# Altium schematic sheet Sheet1.SchDoc
size A4; SheetNumber: 1; SheetTotal: 1
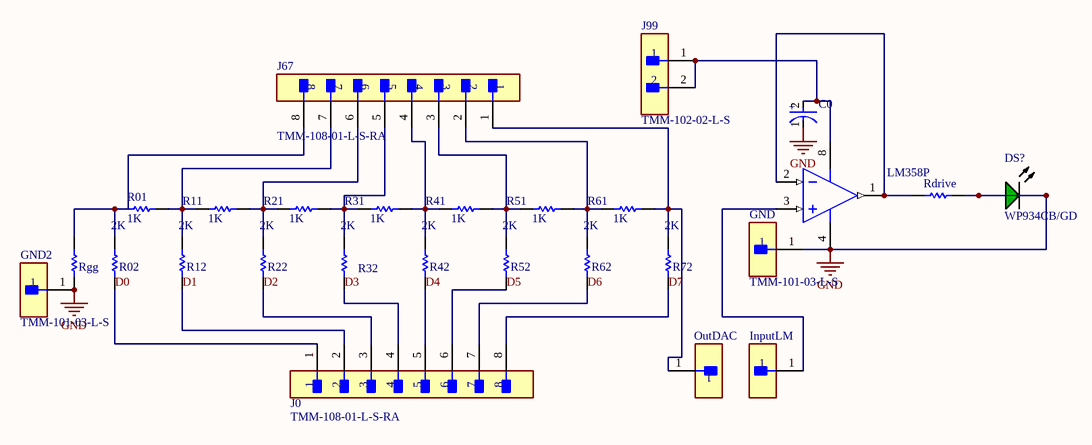
[diagram p0: Sheet1.SchDoc]

## Parts
C0  C0  [FP-RAD-TH-D_10_0_5-L_16_1-MFG]  (value not drawn)
DS?  WP934CB/GD  [KING-WP934CBGD_V]
GND  TMM-101-03-L-S  [FP-TMM-101-03-L-S-MFG]
GND2  TMM-101-03-L-S  [FP-TMM-101-03-L-S-MFG]
InputLM  TMM-101-03-L-S  [FP-TMM-101-03-L-S-MFG]  (value not drawn)
J0  TMM-108-01-L-S-RA  [FP-TMM-108-01-L-S-RA-MFG]
J67  TMM-108-01-L-S-RA  [FP-TMM-108-01-L-S-RA-MFG]
J99  TMM-102-02-L-S  [FP-TMM-102-02-L-S-MFG]
OutDAC  TMM-101-03-L-S  [FP-TMM-101-03-L-S-MFG]  (value not drawn)
R01  1K  [RESA60-630X240]
R02  2K  [RESA60-630X240]
R11  1K  [RESA60-630X240]
R12  2K  [RESA60-630X240]
R21  1K  [RESA60-630X240]
R22  2K  [RESA60-630X240]
R31  1K  [RESA60-630X240]
R32  2K  [RESA60-630X240]
R41  1K  [RESA60-630X240]
R42  2K  [RESA60-630X240]
R51  1K  [RESA60-630X240]
R52  2K  [RESA60-630X240]
R61  1K  [RESA60-630X240]
R62  2K  [RESA60-630X240]
R72  2K  [RESA60-630X240]
Rdrive  drive  [RESA60-630X240]  (value not drawn)
Rgg  gg  [RESA60-630X240]  (value not drawn)
  LM358P  [P0008A]  (part A of 2)

## Nets
GND: C0.1(C) DS?.1(K) DS?.2(A) GND.1 GND2.1 Rdrive.2 Rgg.1 .4(GND)
D0: J0.1 R02.1
D1: J0.2 R12.1
D2: J0.3 R22.1
D3: J0.4 R32.1
D4: J0.5 R42.1
D5: J0.6 R52.1
D6: J0.7 R62.1
D7: J0.8 R72.1
NetC0_2: C0.2(A) J99.1 J99.2 .8(VCC)
NetInputLM_1: InputLM.1 .3(1IN+)
NetJ67_1: J67.1 OutDAC.1 R61.2 R72.2
NetJ67_2: J67.2 R51.2 R61.1 R62.2
NetJ67_3: J67.3 R41.2 R51.1 R52.2
NetJ67_4: J67.4 R31.2 R41.1 R42.2
NetJ67_5: J67.5 R21.2 R31.1 R32.2
NetJ67_6: J67.6 R11.2 R21.1 R22.2
NetJ67_7: J67.7 R01.2 R11.1 R12.2
NetJ67_8: J67.8 R01.1 R02.2 Rgg.2
NetRdrive_1: Rdrive.1 .1(1OUT) .2(1IN-)

## Notes on the sheet
- (in symbol CMP-05427-000698-1) +

## Library data of the parts
C0 = CMP-05427-000698-1: Aluminum Electrolytic Capacitors (Radial Lead Type) AEC-Q200 Qualified 330uF ±20% 50V; Life (Hours): 2000Hour; Ripple Current: 410mA; Lead Diameter: 0.6mm; Lead/Base Style: Straight; Diameter: 10mm; Termination: Radial; Length: 16mm; Construction: RADIAL; Lead Pitch: 5mm; Mount: Through Hole; Max Operating Temperature: 105°C; Package Quantity: 500; Packaging: Ammo Pack; Voltage Rating (DC): 50V; Contact Plating: Tin; Min Operating Temperature: -55°C; Capacitance: 330uF; Height: 16mm; Series: NHG; Tolerance: 20%; RoHS Compliant: Yes; Case/Package: Radial; Radiation Hardening: No
DS? = CMP-2000-07417-1: Right Angle LED Indicator, 62.5 mW, 25 mA, -40 to 85 degC, 2-Pin THD, RoHS, Bulk; Manufacturer: Kingbright; Voltage Rating: 2.2V; Configuration: Single; Other Names: 754-1297 / WP934CBGD; Lens Style/Size: RoundwithDomedTop,3mm; Catalog Drawings: WP934CBSeriesFront / WP934CBSeriesSide; Millicandela Rating: 22.5mcd; Minimum Quantity: Green; 3D Model: WP934CB/x.sldprt / WP934CB/x.pro / WP934CB/x.igs / WP934CB/x.stp; Wavelength - Peak: 568nm; Lens Type: Diffused,Tinted; Dynamic Catalog: SingleLevel3mm(T1)SingleColorRightAngleLEDs; Viewing Angle: 40°; Current: 20mA; Packaging: Bulk; Package Reference: WP934CBGD; Datasheet Version: Rev. 10B, 09/2016; Family: LEDs-CircuitBoardIndicators,Arrays,LightBars,BarGraphs; Manufacturer URL: http://www.kingbright.com/; Standard Package: 500; Mounting Technology: ThroughHole; Quantity Available: Bulk; Category: Optoelectronics; Color: Green; Package Description: 2-Pin Through Hole Device, Body 4.6 x 8.75 mm; Mounting Type: ThroughHole,RightAngle; Datasheet URL: http://www.kingbrightusa.com/images/catalog/SPEC/WP934CB-GD.pdf
GND GND2 InputLM OutDAC = CMP-02766-001507-1: 2MM TERMINAL STRIP; Max Current Rating: 3.9A; Number of Contacts: 1; Max Voltage Rating (AC): 500V; Connector Type: Header; Gender: Male; Termination: Solder; Contact Type: Male Pin; Housing Material: Polymer; Housing Color: Black; Insulation Color: Black; Length: 2mm; Series: TMM; REACH SVHC: No SVHC; Fastening Type: Pull; Contact Plating: Gold; Number of Positions: 1; RoHS Compliant: Yes; Insulation Material: Polymer; Max Operating Temperature: 125°C; Lead Free: Lead Free; Packaging: Bulk; Orientation: Straight; Contact Finish - Mating: GOLD; Min Operating Temperature: -55°C; Number of Rows: 1; Depth: 1.97mm; Contact Shape: Square; Radiation Hardening: No; Contact Material: Bronze
J0 J67 = CMP-02766-001705-1: CONN HEADER R/A 8POS 2MM; Max Current Rating: 3.9A; Number of Contacts: 8; Max Voltage Rating (AC): 500V; Gender: Male; Max Operating Temperature: 125°C; Contact Material: Bronze; Packaging: Bulk; Termination: Solder; Insulation Color: Black; Housing Color: Black; Connector Type: Header; RoHS Compliant: Yes; Length: 16mm; Number of Positions: 8; Min Operating Temperature: -55°C; Contact Finish - Mating: GOLD; Contact Shape: Square; Lead Free: Lead Free; Contact Plating: Gold; Pitch: 2mm; Contact Type: Male Pin; Radiation Hardening: No; Series: TMM; REACH SVHC: No SVHC; Fastening Type: Pull; Orientation: Right Angle; Depth: 5.97mm; Number of Rows: 1; Housing Material: Polymer; Insulation Material: Polymer
J99 = CMP-02766-001483-1: CONN HEADER VERT 2POS 2MM; Max Voltage Rating (AC): 500V; Number of Contacts: 2; Max Current Rating: 3.9A; Gender: Male; Number of Rows: 1; REACH SVHC: No SVHC; Contact Material: Bronze; Length: 4mm; Depth: 1.97mm; Pitch: 2mm; Radiation Hardening: No; Contact Plating: Gold; Min Operating Temperature: -55°C; RoHS Compliant: Yes; Packaging: Bulk; Orientation: Straight; Housing Material: Polymer; Housing Color: Black; Max Operating Temperature: 125°C; Termination: Solder; Lead Free: Lead Free
R01 R02 R11 R12 R21 R22 R31 R32 R41 R42 R51 R52 R61 R62 R72 Rdrive Rgg = CMP-1659-00075-1: Axial Resistor, 1 KOhm, +/- 1%, 250 mW, -55 to 155 degC, 2-Pin THD, RoHS, Bulk; Voltage Rating: 250 V; Resistance: 10 kohm; Power Rating: 250 mW; ComponentLink2Description: Datasheet; RoHSCompliant: true; PackageReference: MFR-25; Case\Package: Axial; Max Operating Temperature: 155 degC; DatasheetVersion: Apr-13; Tolerance: 1%; ComponentLink1URL: http://www.yageo.com/; Length: 0.248 inch; ComponentLink2URL: http://www.yageo.com/documents/recent/Yageo%20LR_MFR_2013.pdf; Packaging: Bulk; Package Quantity: 200; PackageDescription: 2-Pin Axial Lead, Dia 2.4 mm, Body Length 6.3 mm; Min Operating Temperature: -55 degC; ComponentLink1Description: Manufacturer URL
 = CMP-2000-06549-1: Dual Operational Amplifier, 3 to 32 V, 0 to 70 degC, 8-Pin PDIP (P), RoHS, Tape and Reel; Manufacturer: Technik Industrial; Datasheet Version: Rev. T, 04/2015; Datasheet URL: http://www.ti.com/lit/ds/symlink/lm358.pdf; Manufacturer URL: http://www.technik.com.hk/; Package Description: 8-Pin Double In-line Package, Body 9.59 x 6.35 mm, Pitch 2.54 mm; Mounting Technology: ThroughHole; Package URL: http://www.ti.com/lit/ml/mpdi001b/mpdi001b.pdf; Package Reference: P8